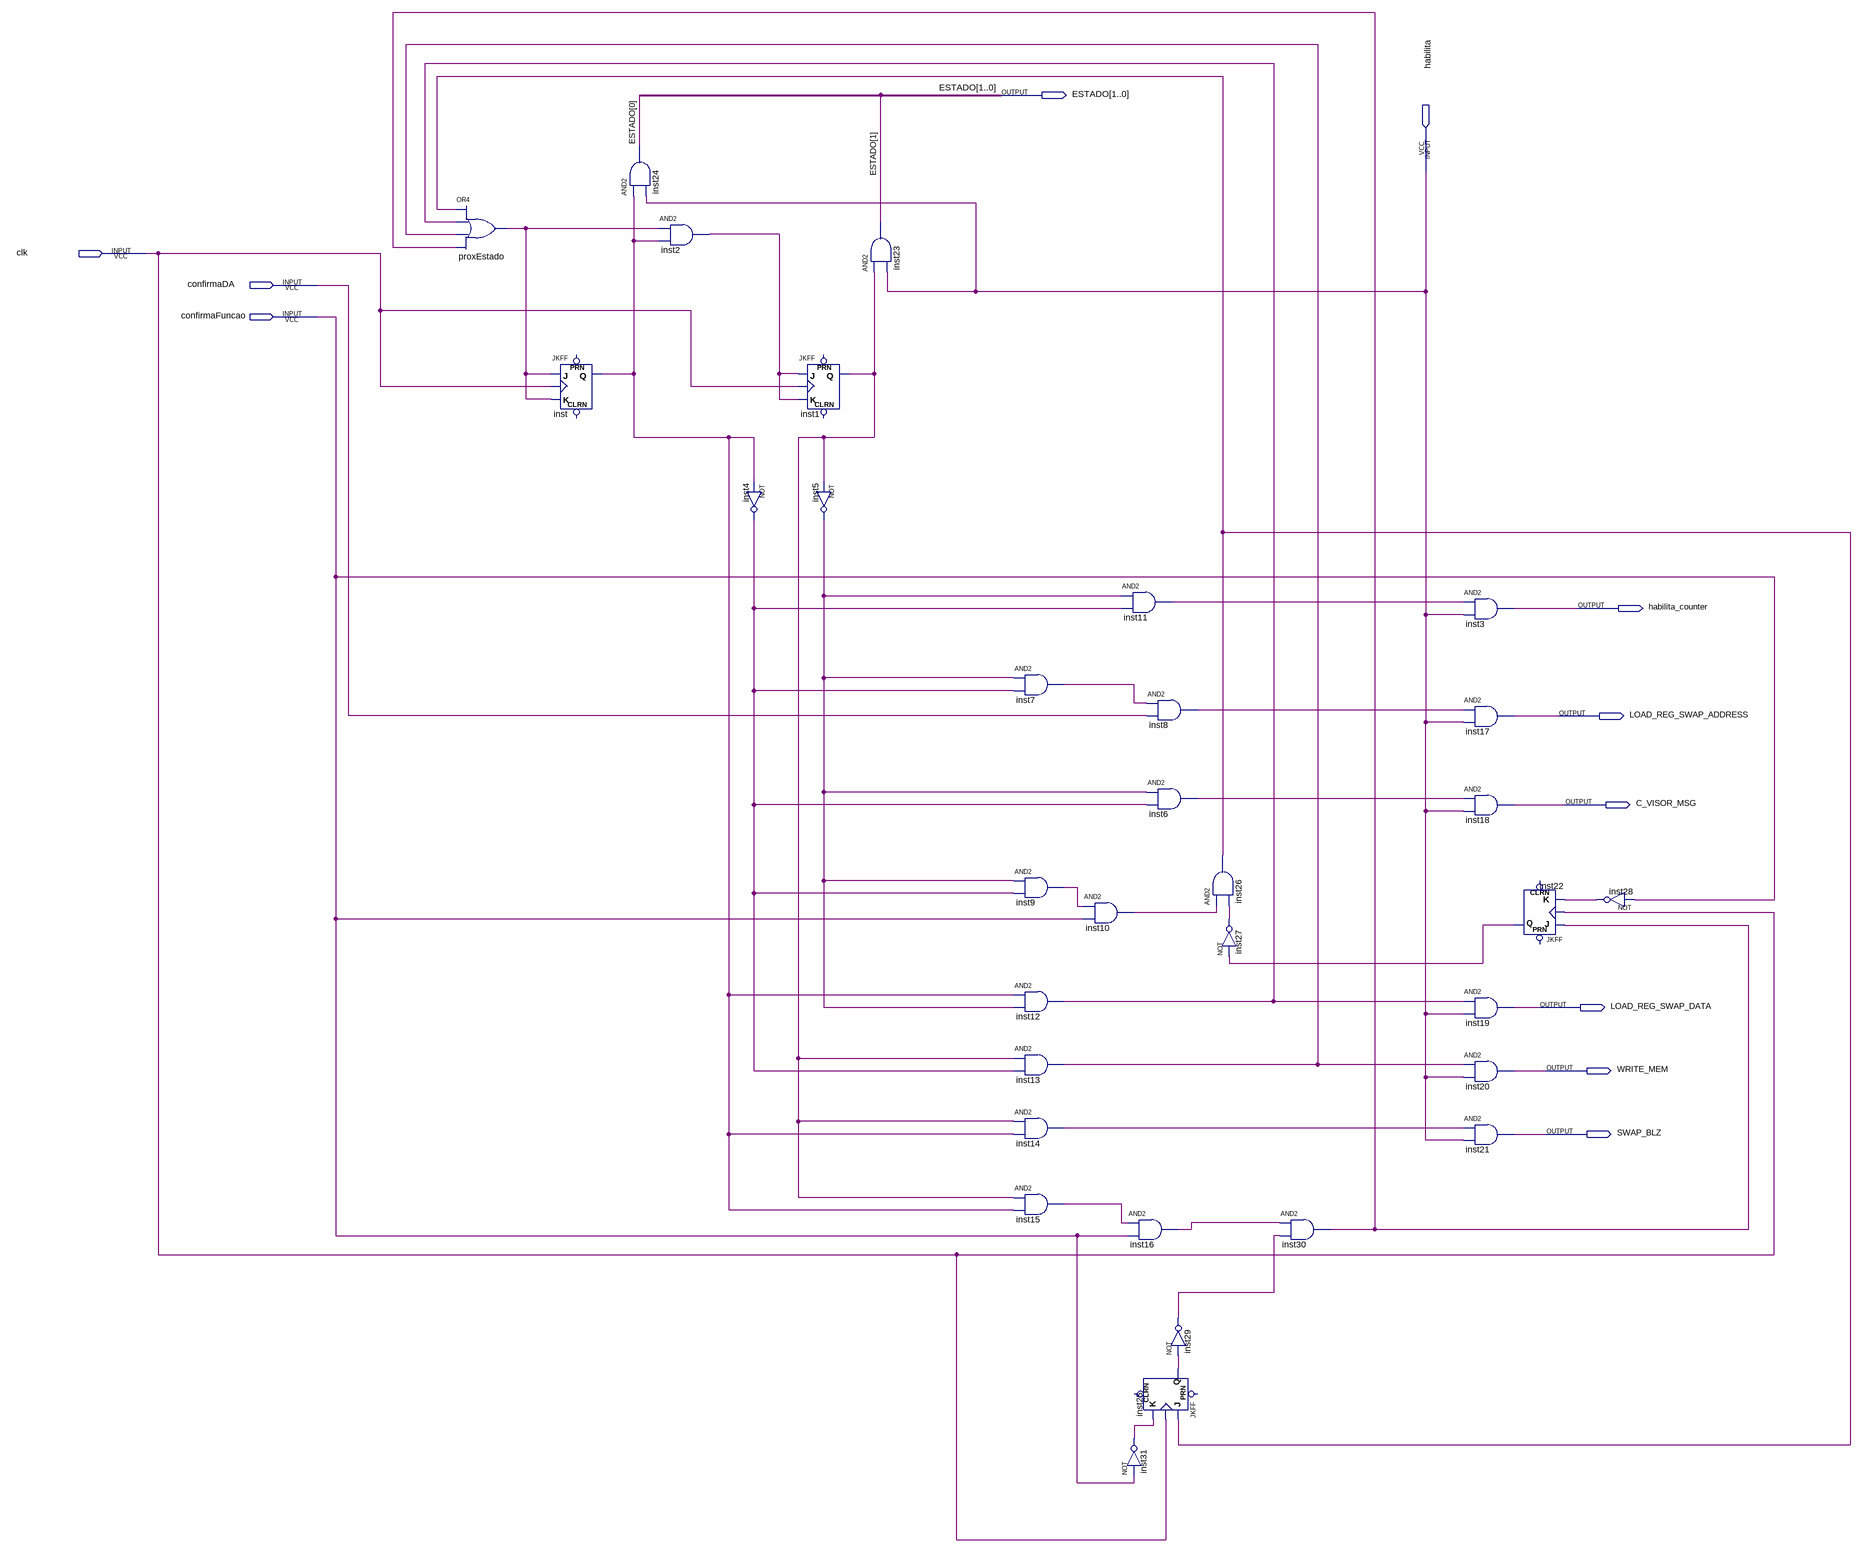
[diagram p0: schematic sheet]
// Quartus schematic MAQUINA_C.bdf as structural Verilog: 33 symbols, 11 pins
module MAQUINA_C (
  input  habilita,
  input  clk,
  input  confirmaDA,
  input  confirmaFuncao,
  output [1:0] ESTADO,
  output habilita_counter,
  output LOAD_REG_SWAP_ADDRESS,
  output C_VISOR_MSG,
  output LOAD_REG_SWAP_DATA,
  output WRITE_MEM,
  output SWAP_BLZ
);

  wire inst1_q, inst2_out, inst4_out, inst5_out, inst6_out, inst7_out, inst8_out, inst9_out, inst10_out,
       inst11_out, inst12_out, inst13_out, inst14_out, inst15_out, inst16_out, inst22_q, inst25_q,
       inst26_out, inst27_out, inst28_out, inst29_out, inst30_out, inst31_out, inst_q, proxEstado_out;

  or proxEstado (proxEstado_out, inst26_out, inst12_out, inst13_out, inst30_out);
  JKFF inst (.K(proxEstado_out), .J(proxEstado_out), .CLK(clk), .Q(inst_q));  // open: PRN, CLRN
  and inst24 (ESTADO[0], inst_q, habilita);
  and inst2 (inst2_out, proxEstado_out, inst_q);
  not inst4 (inst4_out, inst_q);
  JKFF inst1 (.K(inst2_out), .J(inst2_out), .CLK(clk), .Q(inst1_q));  // open: PRN, CLRN
  not inst5 (inst5_out, inst1_q);
  and inst23 (ESTADO[1], inst1_q, habilita);
  and inst7 (inst7_out, inst5_out, inst4_out);
  and inst9 (inst9_out, inst5_out, inst4_out);
  and inst12 (inst12_out, inst_q, inst5_out);
  and inst13 (inst13_out, inst1_q, inst4_out);
  and inst14 (inst14_out, inst1_q, inst_q);
  and inst15 (inst15_out, inst1_q, inst_q);
  and inst11 (inst11_out, inst5_out, inst4_out);
  and inst10 (inst10_out, inst9_out, confirmaFuncao);
  not inst31 (inst31_out, confirmaFuncao);
  and inst8 (inst8_out, inst7_out, confirmaDA);
  and inst6 (inst6_out, inst5_out, inst4_out);
  and inst16 (inst16_out, inst15_out, confirmaFuncao);
  not inst29 (inst29_out, inst25_q);
  JKFF inst25 (.K(inst31_out), .J(inst26_out), .CLK(clk), .Q(inst25_q));  // open: PRN, CLRN
  and inst26 (inst26_out, inst10_out, inst27_out);
  not inst27 (inst27_out, inst22_q);
  and inst30 (inst30_out, inst16_out, inst29_out);
  and inst3 (habilita_counter, inst11_out, habilita);
  and inst17 (LOAD_REG_SWAP_ADDRESS, inst8_out, habilita);
  and inst18 (C_VISOR_MSG, inst6_out, habilita);
  and inst19 (LOAD_REG_SWAP_DATA, inst12_out, habilita);
  and inst20 (WRITE_MEM, inst13_out, habilita);
  and inst21 (SWAP_BLZ, inst14_out, habilita);
  JKFF inst22 (.K(inst28_out), .J(inst30_out), .CLK(clk), .Q(inst22_q));  // open: PRN, CLRN
  not inst28 (inst28_out, confirmaFuncao);
endmodule
